# Altium schematic sheet AtoD Conversion.SchDoc
size A4; SheetNumber: 4; SheetTotal: 4
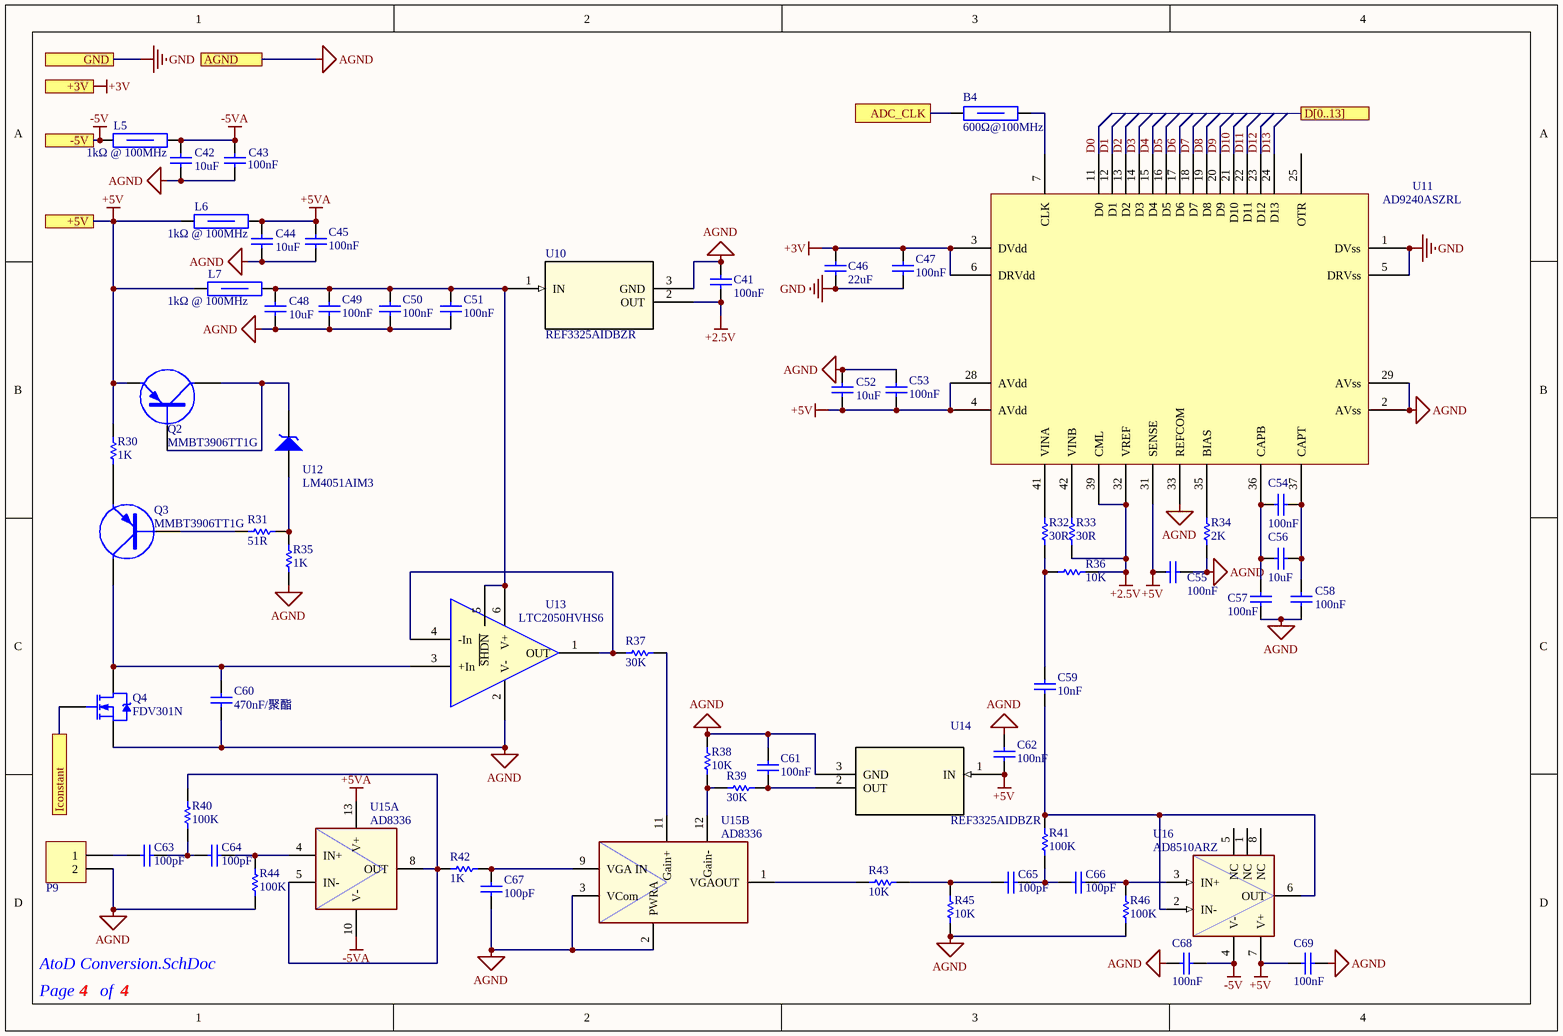
[diagram p0: AtoD Conversion.SchDoc]

## Parts
B4  600Ω@100MHz  [R0805_L]
C41  100nF  [R0603_C]
C42  10uF  [R0805_C]
C43  100nF  [R0603_C]
C44  10uF  [R0805_C]
C45  100nF  [R0603_C]
C46  22uF  [R0805_C]
C47  100nF  [R0603_C]
C48  10uF  [R0805_C]
C49  100nF  [R0603_C]
C50  100nF  [R0603_C]
C51  100nF  [R0603_C]
C52  10uF  [R0805_C]
C53  100nF  [R0603_C]
C54  100nF  [R0603_C]
C55  100nF  [R0603_C]
C56  10uF  [R0805_C]
C57  100nF  [R0603_C]
C58  100nF  [R0603_C]
C59  10nF  [R0603_C]
C60  470nF/聚酯  [P=10MM -L]
C61  100nF  [R0603_C]
C62  100nF  [R0603_C]
C63  100pF  [R0603_C]
C64  100pF  [R0603_C]
C65  100pF  [R0603_C]
C66  100pF  [R0603_C]
C67  100pF  [R0603_C]
C68  100nF  [R0603_C]
C69  100nF  [R0603_C]
L5  1kΩ @ 100MHz  [R1206_L]
L6  1kΩ @ 100MHz  [R1206_L]
L7  1kΩ @ 100MHz  [R1206_L]
P9  Header 2  [CP1X2]  (value not drawn)
Q2  MMBT3906TT1G  [SOT-23(SOT-23-3)]
Q3  MMBT3906TT1G  [SOT-23(SOT-23-3)]
Q4  FDV301N  [SOT-23]
R30  1K  [R0603_R]
R31  51R  [R0603_R]
R32  30R  [R0603_R]
R33  30R  [R0603_R]
R34  2K  [R0603_R]
R35  1K  [R0603_R]
R36  10K  [R0603_R]
R37  30K  [R0603_R]
R38  10K  [R0603_R]
R39  30K  [R0603_R]
R40  100K  [R0603_R]
R41  100K  [R0603_R]
R42  1K  [R0603_R]
R43  10K  [R0603_R]
R44  100K  [R0603_R]
R45  10K  [R0603_R]
R46  100K  [R0603_R]
U10  REF3325AIDBZR  [SOT-23(SOT-23-3)]
U11  AD9240ASZRL  [MQFP44]
U12  LM4051AIM3  [SOT-23(SOT-23-3)]
U13  LTC2050HVHS6  [DBV0006A_N]
U14  REF3325AIDBZR  [SOT-23(SOT-23-3)]
U15  AD8336  [LFCSP16]  (parts A,B of 2)
U16  AD8510ARZ  [SOP-8_150mil]

## Ports
+3V, +5V, -5V, ADC_CLK, AGND, D[0..13], GND, Iconstant

## Nets
+2.5V: C41.2 R33.1 R36.1 U10.2(OUT) U11.32(VREF) U11.39(CML)
+3V: C46.2 C47.2 U11.3(DVdd) U11.6(DRVdd) ; port +3V
+5V: C52.1 C53.1 C55.2 C62.1 C69.2 L6.1 L7.1 Q2.2(E) R30.2 U11.4(AVdd) U11.28(AVdd) U11.31(SENSE) U14.1(IN) U16.7(V+) ; port +5V
+5VA: C44.2 C45.2 L6.2 U15.13(V+)
-5V: C68.1 L5.1 U16.4(V-) ; port -5V
-5VA: C42.2 C43.2 L5.2 U15.10(V-)
AGND: C41.1 C42.1 C43.1 C44.1 C45.1 C48.1 C49.1 C50.1 C51.1 C52.2 C53.2 C55.1 C57.2 C58.2 C60.1 C61.2 C62.2 C67.1 C68.2 C69.1 P9.2 Q4.2(S) R34.1 R35.1 R38.2 R44.2 R45.1 R46.2 U10.3(GND) U11.2(AVss) U11.29(AVss) U11.33(REFCOM) U13.2(V-) U14.3(GND) U15.2(PWRA) U15.3(VCom) ; port AGND
GND: C46.1 C47.1 U11.1(DVss) U11.5(DRVss) ; port GND
ADC_CLK: B4.1 ; port ADC_CLK
D0: U11.11(D0)
D1: U11.12(D1)
D2: U11.13(D2)
D3: U11.14(D3)
D4: U11.15(D4)
D5: U11.16(D5)
D6: U11.17(D6)
D7: U11.18(D7)
D8: U11.19(D8)
D9: U11.20(D9)
D10: U11.21(D10)
D11: U11.22(D11)
D12: U11.23(D12)
D13: U11.24(D13)
Iconstant: Q4.1(G) ; port Iconstant
NetB4_2: B4.2 U11.7(CLK)
NetC48_2: C48.2 C49.2 C50.2 C51.2 L7.2 U10.1(IN) U13.5(~{SHDN}) U13.6(V+)
NetC54_1: C54.1 C56.1 C58.1 U11.37(CAPT)
NetC54_2: C54.2 C56.2 C57.1 U11.36(CAPB)
NetC59_1: C59.1 R41.1 U16.2(IN-) U16.6(OUT)
NetC59_2: C59.2 R32.1 R36.2
NetC60_2: C60.2 Q3.3(C) Q4.3(D) U13.3(+In)
NetC61_1: C61.1 R39.1 U14.2(OUT)
NetC63_1: C63.1 P9.1
NetC63_2: C63.2 C64.1 R40.2
NetC64_2: C64.2 R44.1 U15.4(IN+)
NetC65_1: C65.1 R43.1 R45.2
NetC65_2: C65.2 C66.1 R41.2
NetC66_2: C66.2 R46.1 U16.3(IN+)
NetC67_2: C67.2 R42.1 U15.9(VGA_IN)
NetQ2_1: Q2.1(B) Q2.3(C) U12.1
NetQ3_1: Q3.1(B) R31.1
NetQ3_2: Q3.2(E) R30.1
NetR31_2: R31.2 R35.2 U12.2
NetR32_2: R32.2 U11.41(VINA)
NetR33_2: R33.2 U11.42(VINB)
NetR34_2: R34.2 U11.35(BIAS)
NetR37_1: R37.1 U13.1(OUT) U13.4(-In)
NetR37_2: R37.2 U15.11(Gain+)
NetR38_1: R38.1 R39.2 U15.12(Gain-)
NetR40_1: R40.1 R42.2 U15.5(IN-) U15.8(OUT)
NetR43_2: R43.2 U15.1(VGAOUT)

Not connected (* = marked no-connect by the designer): U11 25(OTR); U16 1(NC) 5(NC) 8(NC)

## Notes on the sheet
- Page
- of

## Library data of the parts
B4 = 600Ω@100MHz: 600Ω @ 100MHz / 线路数 1 / 额定电流（最大） 600mA / 直流电阻（DCR）（最大） 210mΩ; 厂家: muRata(村田); 型号: BLM21AG601SN1D; 封装: 0805; 类型: Bead; 订货编码: C85837
C41 C43 C45 C47 C49-C51 C53-C55 C57 C58 C61 C62 C68 C69 = 100nF/0603/50V: 精度 ±10% / 容值 100nF / 额定电压 50V / 温漂系数（介质材料) X7R; 厂家: FH(风华); 型号: 0603B104K500NT; 封装: 0603; 类型: Capacitor; 订货编码: C30926
C42 C44 C48 C52 C56 = 10uF/0805/16V: 精度 ±10% / 容值 10uF / 额定电压 16V / 温漂系数（介质材料) X7R; 厂家: FH(风华); 型号: 0805B106K160NT; 封装: 0805; 类型: Capacitor; 订货编码: C92341
C46 = 22uF/0805/25V: 精度 ±20% / 容值 22uF / 额定电压 25V / 温漂系数（介质材料) X5R; 厂家: muRata(村田); 型号: GRM21BR61E226ME44L; 封装: 0805; 类型: Capacitor; 订货编码: C86816
C59 = 10nF/0603/C0G/50V: 精度 ±5% / 容值 10nF / 额定电压 50V / 温漂系数（介质材料) C0G; 厂家: FH(风华); 型号: 0603CG103J500NT; 封装: 0603; 类型: Capacitor; 订货编码: C82282
C60 = 470nF/10mm/450V: 聚酯薄膜电容 / 脚间距（mm） 10 / 精度 ±5% / 容值 470nF / 额定直流耐压DC 450V / 工作温度 -55℃ ~ +105℃; 厂家: faratronic(厦门法拉); 型号: C222S474J40Y350; 封装: P=10mm; 类型: Capacitor; 订货编码: C280341
C63-C67 = 100pF/0603/50V: 精度 ±5% / 容值 100pF / 额定电压 50V / 温漂系数（介质材料) C0G; 厂家: FH(风华); 型号: 0603CG101J500NT; 封装: 0603; 类型: Capacitor; 订货编码: C1635
L5-L7 = 1kΩ@100MHz: 阻抗 @ 频率 1kΩ @ 100MHz / 线路数 1 / 额定电流（最大） 2A / 直流电阻（DCR）（最大） 120mΩ; 厂家: FH(风华); 型号: CBM321609U102T; 封装: 1206; 类型: Bead; 订货编码: C139169
P9 = Header 2: Header, 2-Pin; 厂家: /; System: Connector; 型号: /; 封装: /; 类型: /; 订货编码: /
Q2 Q3 = MMBT3906TT1G: 额定功率 200mW / 集电极电流Ic 200mA / 集射极击穿电压Vce 40V / 晶体管类型 PNP; 厂家: ON(安森美); 封装: SOT23-3; 订货编码: C82042; 型号: MMBT3906TT1G; 类型: PNP
Q4 = FDV301N: 漏源电压（Vdss） 25V / 连续漏极电流（Id）（25°C 时） 220mA / 栅源极阈值电压 1.06V @ 250uA / 漏源导通电阻 4Ω @ 400mA,4.5V / 最大功率耗散（Ta=25°C） 350mW / 类型 N沟道; 厂家: ON(安森美); 封装: SOT-23-3; 类型: MOS(场效应管); 订货编码: C15310; 型号: FDV301N
R30 R35 R42 = 1K/0603: 精度 ±1% / 温度系数 ±100ppm/℃ / 阻值 1kΩ / 功率 0.1W; 厂家: FH(风华); 型号: RS-03K1001FT; 类型: Resistor; 订货编码: C115325; 封装: 0603
R31 = 51R/0603: 精度 ±1% / 温度系数 ±100ppm/℃ / 功率 0.1W / 阻值 51Ω; 厂家: FH(风华); 型号: RS-03K51R0FT; 类型: Resistor; 订货编码: C146828; 封装: 0603
R32 R33 = 30R/0603: 精度 ±1% / 阻值 30Ω / 温度系数 ±100ppm/℃ / 功率 0.1W; 厂家: FH(风华); 型号: RS-03K30R0FT; 类型: Resistor; 订货编码: C321848; 封装: 0603
R34 = 2K/0603: 精度 ±1% / 阻值 2kΩ / 温度系数 ±100ppm/℃ / 功率 0.1W; 厂家: FH(风华); 型号: RS-03K2001FT; 类型: Resistor; 订货编码: C115336; 封装: 0603
R36 R38 R43 R45 = 10K/0603: 精度 ±1% / 温度系数 ±100ppm/℃ / 阻值 10kΩ / 功率 0.1W; 厂家: FH(风华); 型号: RS-03K1002FT; 类型: Resistor; 订货编码: C115324; 封装: 0603
R37 R39 = 30K/0603: 精度 ±1% / 阻值 30kΩ / 温度系数 ±100ppm/℃ / 功率 0.1W; 厂家: FH(风华); 型号: RS-03K3002FT; 类型: Resistor; 订货编码: C140100; 封装: 0603
R40 R41 R44 R46 = 100K/0603: 精度 ±1% / 阻值 100kΩ / 温度系数 ±100ppm/℃ / 功率 0.1W; 厂家: FH(风华); 型号: RS-03K1003FT; 类型: Resistor; 订货编码: C115320; 封装: 0603
U10 U14 = REF3325AIDBZR: 输出电压（最小值/固定） 2.5V / 输出电流 5mA / 输出电压（最大值） - / 输入电压 2.7 V ~ 5.5 V / 电源电流 8.5uA / 输出类型 固定 / 工作温度 -40°C ~ 125°C(TA) / 温度系数 30ppm/°C / 阴极电流 - / 精度 ±0.15% / 参考源类型 系列; 厂家: TI(德州仪器); 封装: SOT23-3; 类型: 电源参考; 订货编码: C69039; 型号: REF3325AIDBZR
U11 = AD9240ASZRL: 模数转换芯片 / 读写接口类型 Parallel / 工作电压 5V / 输入类型 Differential, Single Ended / 参考类型 External, Internal / 输入数 1 / 采样率（sps） 10M / A/D 位数 14; 厂家: ADI(亚德诺); 封装: MQFP-44; 订货编码: C38677; 型号: AD9240ASZRL; 类型: 模数转换芯片
U12 = LM4051AIM3-ADJ/NOPB: 1.212V / 输出电流 12mA / 输出电压（最大值） 10V / 输入电压 - / 电源电流 - / 输出类型 可调式 / 工作温度 -40°C ~ 85°C(TA) / 温度系数 50ppm/°C / 阴极电流 65uA / 精度 ±0.1% / 参考源类型 分流器; 厂家: TI(德州仪器); 封装: SOT-23; 类型: 并联电压参考; 订货编码: C181558; 型号: LM4051AIM3-ADJ/NOPB
U13 = LTC2050HVHS6: 厂家: ADI(亚德诺); 型号: LTC2050HVHS6#TRPBF; 封装: TSOT-23-6; 类型: 运放; 订货编码: C679145
U15 = AD8336ACPZ WP: 厂家: ADI(亚德诺); 封装: LFCSP-16; 类型: 特殊功能放大器; 订货编码: C1523374; 型号: AD8336ACPZ WP
U16 = AD8510ARZ: FET输入运放 / 增益带宽积（GBP） 8MHz / 放大器组数 1 / 输出类型 - / 运放类型 J-FET / 各通道功耗 - / 压摆率（SR） 20 V/us / 工作温度 -40°C ~ 125°C / 电源电压 ±4.5V ~ 18V; 厂家: TI(德州仪器); 型号: AD8510ARZ-REEL7; 封装: SOIC-8_150mil; 类型: 运放; 订货编码: C44017